# Altium schematic sheet GNSS_SUPPORT.SchDoc
size A4; SheetNumber: 5; SheetTotal: 7
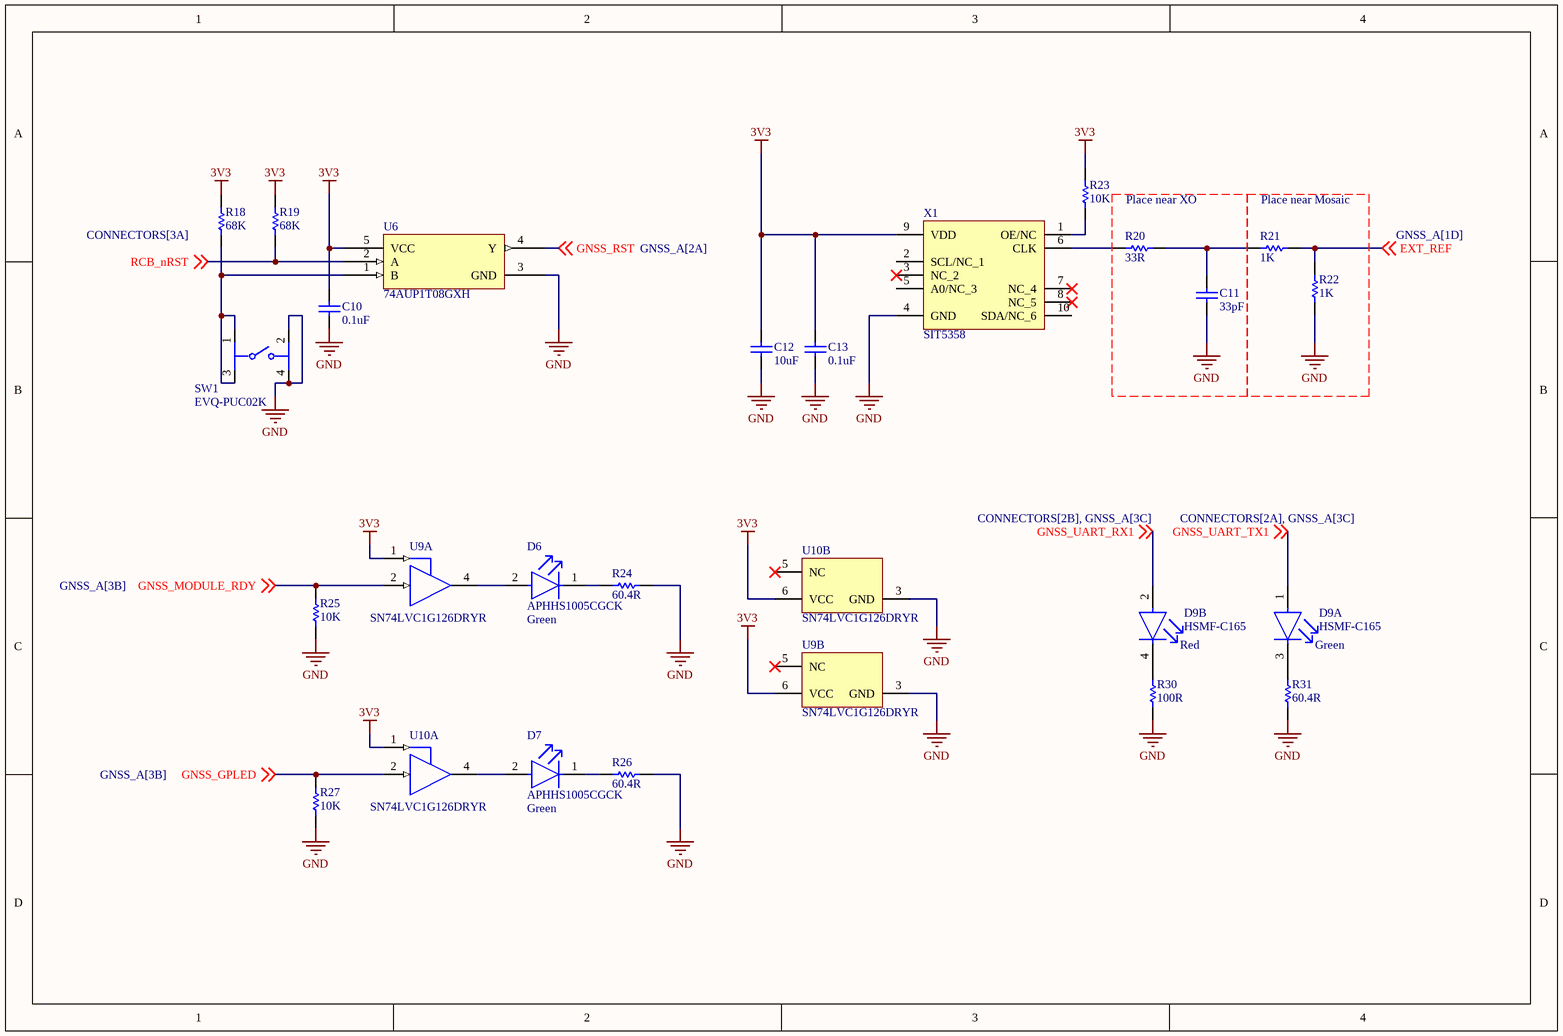
[diagram p0: GNSS_SUPPORT.SchDoc]

## Parts
C10  0.1uF  [CAPC1005X56X25LL10T15]
C11  33pF  [CAPC1005X55X25ML05T10]
C12  10uF  [CAPC1005X70X10LL05]
C13  0.1uF  [CAPC1005X56X25LL10T15]
D6  APHHS1005CGCK  Color: Green  [FP-APHHS1005CGCK-MFG]
D7  APHHS1005CGCK  Color: Green  [FP-APHHS1005CGCK-MFG]
D9  HSMF-C165  [FP-HSMF-C165-MFG]  (parts A,B of 2)
R18  68K  [RESC1005X40X25LL10T10]
R19  68K  [RESC1005X40X25LL10T10]
R20  33R  [RESC1005X40X25LL05T10]
R21  1K  [RESC1005X40X25LL05T10]
R22  1K  [RESC1005X40X25LL05T10]
R23  10K  [RESC1005X40X25ML05T10]
R24  60.4R  [RESC1005X40X25ML05T05]
R25  10K  [RESC1005X40X25ML05T10]
R26  60.4R  [RESC1005X40X25ML05T05]
R27  10K  [RESC1005X40X25ML05T10]
R30  100R  [RESC1005X40X25LL05T05]
R31  60.4R  [RESC1005X40X25ML05T05]
SW1  EVQ-PUC02K  [FP-EVQ-PUC02K-MFG]
U6  74AUP1T08GXH  [X2SON5_SOT1226_NEX]
U9  SN74LVC1G126DRYR  [DRY0006A_V]  (parts A,B of 2)
U10  SN74LVC1G126DRYR  [DRY0006A_V]  (parts A,B of 2)
X1  SIT5358  [SIT5358]

## Nets
3V3: C10.2 C12.2 C13.2 R18.2 R19.2 R23.2 U6.5(VCC) U9.1(OE) U9.6(VCC) U10.1(OE) U10.6(VCC) X1.9(VDD)
GND: C10.1 C11.1 C12.1 C13.1 R22.1 R24.1 R25.1 R26.1 R27.1 R30.1 R31.2 SW1.2 SW1.4 U6.3(GND) U9.3(GND) U10.3(GND) X1.4(GND)
EXT_REF: R21.2 R22.2 ; off-sheet EXT_REF
GNSS_GPLED: R27.2 U10.2(A) ; off-sheet GNSS_GPLED
GNSS_MODULE_RDY: R25.2 U9.2(A) ; off-sheet GNSS_MODULE_RDY
GNSS_RST: U6.4(Y) ; off-sheet GNSS_RST
GNSS_UART_RX1: D9.2(RED_A) ; off-sheet GNSS_UART_RX1
GNSS_UART_TX1: D9.1(GREEN_A) ; off-sheet GNSS_UART_TX1
RCB_nRST: R19.1 U6.2(A) ; off-sheet RCB_nRST
NetC11_2: C11.2 R20.2 R21.1
NetD6_1: D6.1(C) R24.2
NetD6_2: D6.2(A) U9.4(Y)
NetD7_1: D7.1(C) R26.2
NetD7_2: D7.2(A) U10.4(Y)
NetD9_3: D9.3(GREEN_C) R31.1
NetD9_4: D9.4(RED_C) R30.2
NetR18_1: R18.1 SW1.1 SW1.3 U6.1(B)
NetR20_1: R20.1 X1.6(CLK)
NetR23_1: R23.1 X1.1(OE/NC)

Not connected (* = marked no-connect by the designer): U9 5(NC)*; U10 5(NC)*; X1 2(SCL/NC_1) 3(NC_2)* 5(A0/NC_3) 7(NC_4)* 8(NC_5)* 10(SDA/NC_6)

## Notes on the sheet
- Place near XO
- (near R21) Place near Mosaic
- Red
- Green

## Library data of the parts
C10 C13 = CMP-2008-02743-1: Manufacturer: AVX Interconnect / Elco; Part Number: 04026D104KAT2A
C11 = CMP-2008-04338-1: Part Number: GRM1555C1H330JZ01D; Manufacturer: Murata
C12 = CMP-2000-05993-1: Chip Capacitor, 10 uF, +/- 20%, -55 to 85 degC, 0402 (1005 Metric), RoHS, Tape and Reel; PCN Part Number: MLCCPartNumberChange30/Nov/2012; Manufacturer: TDK; Voltage - Rated: 6.3V; Capacitance: 10µF; Product Training Modules: CSeriesGeneralApplicationsSEAT,CCV,andTVCLDesignToolsGuidetoReplacinganElectrolyticCapacitorwithanMLCC; Online Catalog: CSeries,GeneralPurpose; Kits: 445-9021-KIT-ND-KITMLCC100PF-10UF04026.3-50V445-9003-KIT-ND-KITCAPCERHICAPMLCCSMD; Temperature Coefficient: X5R; Other Names: 445-8920-1; Standard Package: 1; Datasheet URL: http://download.siliconexpert.com/pdfs/2015/4/21/15/54/45/779/tdk_/manual/37024850441143360mlcc_commercial_general_en.pdf; Package Description: 2-Pin Surface Mount Device, Body 1.00 x 0.50 mm; Lead Style: -; RoHS Information: RoHSCertificate-MLCC; Mounting Technology: SurfaceMount; Manufacturer URL: http://www.tdk.com/; Packaging: CutTape(CT); Series: C; Category: Capacitors; Operating Temperature: -55°C~85°C; Ratings: -; Applications: GeneralPurpose; Lead Spacing: -; Family: CeramicCapacitors; Mounting Type: SurfaceMount,MLCC; Package / Case: 0402(1005Metric); Features: -; Thickness (Max): 0.020"(0.50mm); Size / Dimension: 0.039"Lx0.020"W(1.00mmx0.50mm); Datasheet Version: 03/2015; Package Reference: 0402; Tolerance: ±20%; Height - Seated (Max): -
D6 D7 = CMP-44529-000044-1: LED GREEN CLEAR CHIP SMD; Viewing Angle: 120°; Dominant Wavelength: 570nm; Test Current: 20mA; Luminous Intensity: 50mcd; Forward Voltage: 2.1V; Number of LEDs: 1; Lens Color: Clear; Packaging: Tape and Reel; Max Operating Temperature: 85°C; Illumination Color: Green; Length: 1mm; Mount: Surface Mount; Lens Style: Clear; Number of Pins: 2; Wavelength: 570nm; Case/Package: 0402; Width: 0.5mm; Package Quantity: 2000; Case Code (Metric): 1005; Height: 0.6mm; Lead Free: Lead Free; Case Code (Imperial): 0402; Forward Current: 20mA; Min Operating Temperature: -40°C
D9 = CMP-2000-06424-2: LED GREEN/RED DIFFUSED 0603 SMD; Reverse Voltage: 5V; Dominant Wavelength: 621nm; Number of Elements: 2; Shape: Rectangular; Luminous Intensity: 10mcd; Forward Current: 20mA; Lens Color: White; Illumination Color: Green; Power Dissipation: 52mW; Wavelength: 572nm; Viewing Angle: 120°; Forward Voltage: 2.2V; Max Operating Temperature: 85°C; Lens Transparency: Diffused; Width: 0.8mm; Case/Package: 0603; Packaging: Tape and Reel; Case Code (Metric): 1608; Depth: 0.8mm; REACH SVHC: No SVHC; Number of LEDs: 2; Radiation Hardening: No; Lens Style: Rectangular; Color: Green; Case Code (Imperial): 0603; Min Operating Temperature: -40°C; Power Rating: 52mW; Number of Pins: 4; Number of Terminals: 4; Package Quantity: 1; Mount: Surface Mount; Height: 0.5mm; Length: 1.6mm; Lead Free: Lead Free; Test Current: 20mA
R18 R19 = CMP-2002-05893-1: Part Number: ERA2AEB683X; Manufacturer: Panasonic
R20 = CMP-2002-07619-1: Part Number: RC0402FR-0733RL; Manufacturer: Yageo / Phycomp
R21 R22 = CMP-2002-03045-1: Part Number: CRCW04021K00FKEDHP; Manufacturer: Vishay Dale
R23 R25 R27 = CMP-2002-03043-1: Part Number: CRCW040210K0FKEDHP; Manufacturer: Vishay Dale
R24 R26 R31 = CMP-2002-01009-1: Part Number: ERJ-2RKF6040X; Manufacturer: Panasonic
R30 = CMP-2002-00605-3: Chip Resistor, 100 Ohm, +/- 1%, 100 mW, -55 to 155 degC, 0402 (1005 Metric), RoHS, Tape and Reel; Manufacturer: Basic Passives; PartNumber: ERJ-2RKF1000X; Power Rating: 100 mW; Resistance: 100 Ohm; Voltage Rating: 50 V; Case\/Package: 0402; Width: 0.5 mm; Pins: 2; ComponentLink2Description: Datasheet; PackageReference: 0402; Height: 0.35 mm; Tolerance: 1%; DatasheetVersion: 04/2015; Case Code (Imperial): 0402; Min Operating Temperature: -55 degC; Radiation Hardening: No; Length: 1 mm; Package Quantity: 10000; PackageDescription: 2-Pin Surface Mount Device, Body 1 x 0.5 mm; Mounting Technology: Surface Mount; Case Code (Metric): 1005; Packaging: Tape and Reel; ComponentLink1URL: http://www.panasonic.com/; RoHSCompliant: true; Max Operating Temperature: 155 degC; REACH SVHC: Yes; ComponentLink1Description: Manufacturer URL; ComponentLink2URL: http://industrial.panasonic.com/cdbs/www-data/pdf/RDA0000/AOA0000C86.pdf; Mount: Surface Mount
SW1 = CMP-05618-000046-1: SWITCH TACTILE SPST-NO 0.05A 12V; Current Rating: 50mA; Operating Force: 2.2N; Actuator Color: Black; Mechanical Life: 100000Cycles; Switch Function: Off-Mom; Switch Travel: 0.3mm; Throw Configuration: SPST; Contact Resistance: 500mR; Illumination Type: Non-Illuminated; Actuator Length: 1mm; Mount: Surface Mount; Contact Plating: Silver; Series: EVQPU; Packaging: Tape and Reel; Height: 1.65mm; Radiation Hardening: No; Termination: Gull Wing; Depth: 4.5mm; Max Operating Temperature: 70°C; RoHS Compliant: Yes; Contact Current Rating: 50mA; Length: 6.4mm; Electrical Life: 100000Cycles; Max Voltage Rating (DC): 12V; Package Quantity: 1; Width: 3.5mm; Min Operating Temperature: -40°C; Max Current Rating: 50mA; Orientation: Straight; Voltage Rating (DC): 12V; Size: 3.5mm; Lead Free: Lead Free
U6 = 74AUP1T08GXH: No Description Available; Mfr_Name: Nexperia; Copyright: Copyright (C) 2023 Ultra Librarian. All rights reserved.; Manufacturer_Part_Number: 74AUP1T08GXH; Digi-Key_Part_Number_1: 1727-7785-2-ND; Digi-Key_Part_Number_2: 1727-7785-1-ND; Digi-Key_Part_Number_3: 1727-7785-6-ND; RefDes: RefDes; Type: DEV
U9 U10 = CMP-0859-00836-3: Single Bus Buffer Gate With 3-State Outputs, DRY0006A, LARGE T&R; Manufacturer: Texas Instruments; Sub-Family: Non-Inverting Buffer/Driver; Bits(#): 1; Output Type: CMOS; Output Drive (IOL/IOH)(Max)(mA): 32/-32; VCC(Min)(V): 1.65; Logic: True; Voltage(Nom)(V): 1.8,2.5,3.3,5; Input Type: CMOS/TTL; 3-State Output: Yes; F @ Nom Voltage(Max)(Mhz): 150; Schmitt Trigger: No; VCC(Max)(V): 5.5; Rating: Catalog; Technology Family: LVC; ICC @ Nom Voltage(Max)(mA): 0.01; tpd @ Nom Voltage(Max)(ns): 8,5.5,4.5,4; DatasheetVersion: SCES224R; Generic Part Number: SN74LVC1G126; PackageReference: DRY0006A; Operating Temperature Range(C): -40 to 125,-40 to 85
X1 = SIT5358: 1 to 60 MHz, ±50 ppb Super-TCXO; Manufacturer_Name: SiTime; Manufacturer_Part_Number: SIT5358AN-FR-33N0-10.000000; Geometry.Height: 1.06mm; Arrow Part Number: *; Arrow Price/Stock: *